# EAGLE design rascsi-right (EAGLE 8.0.1)
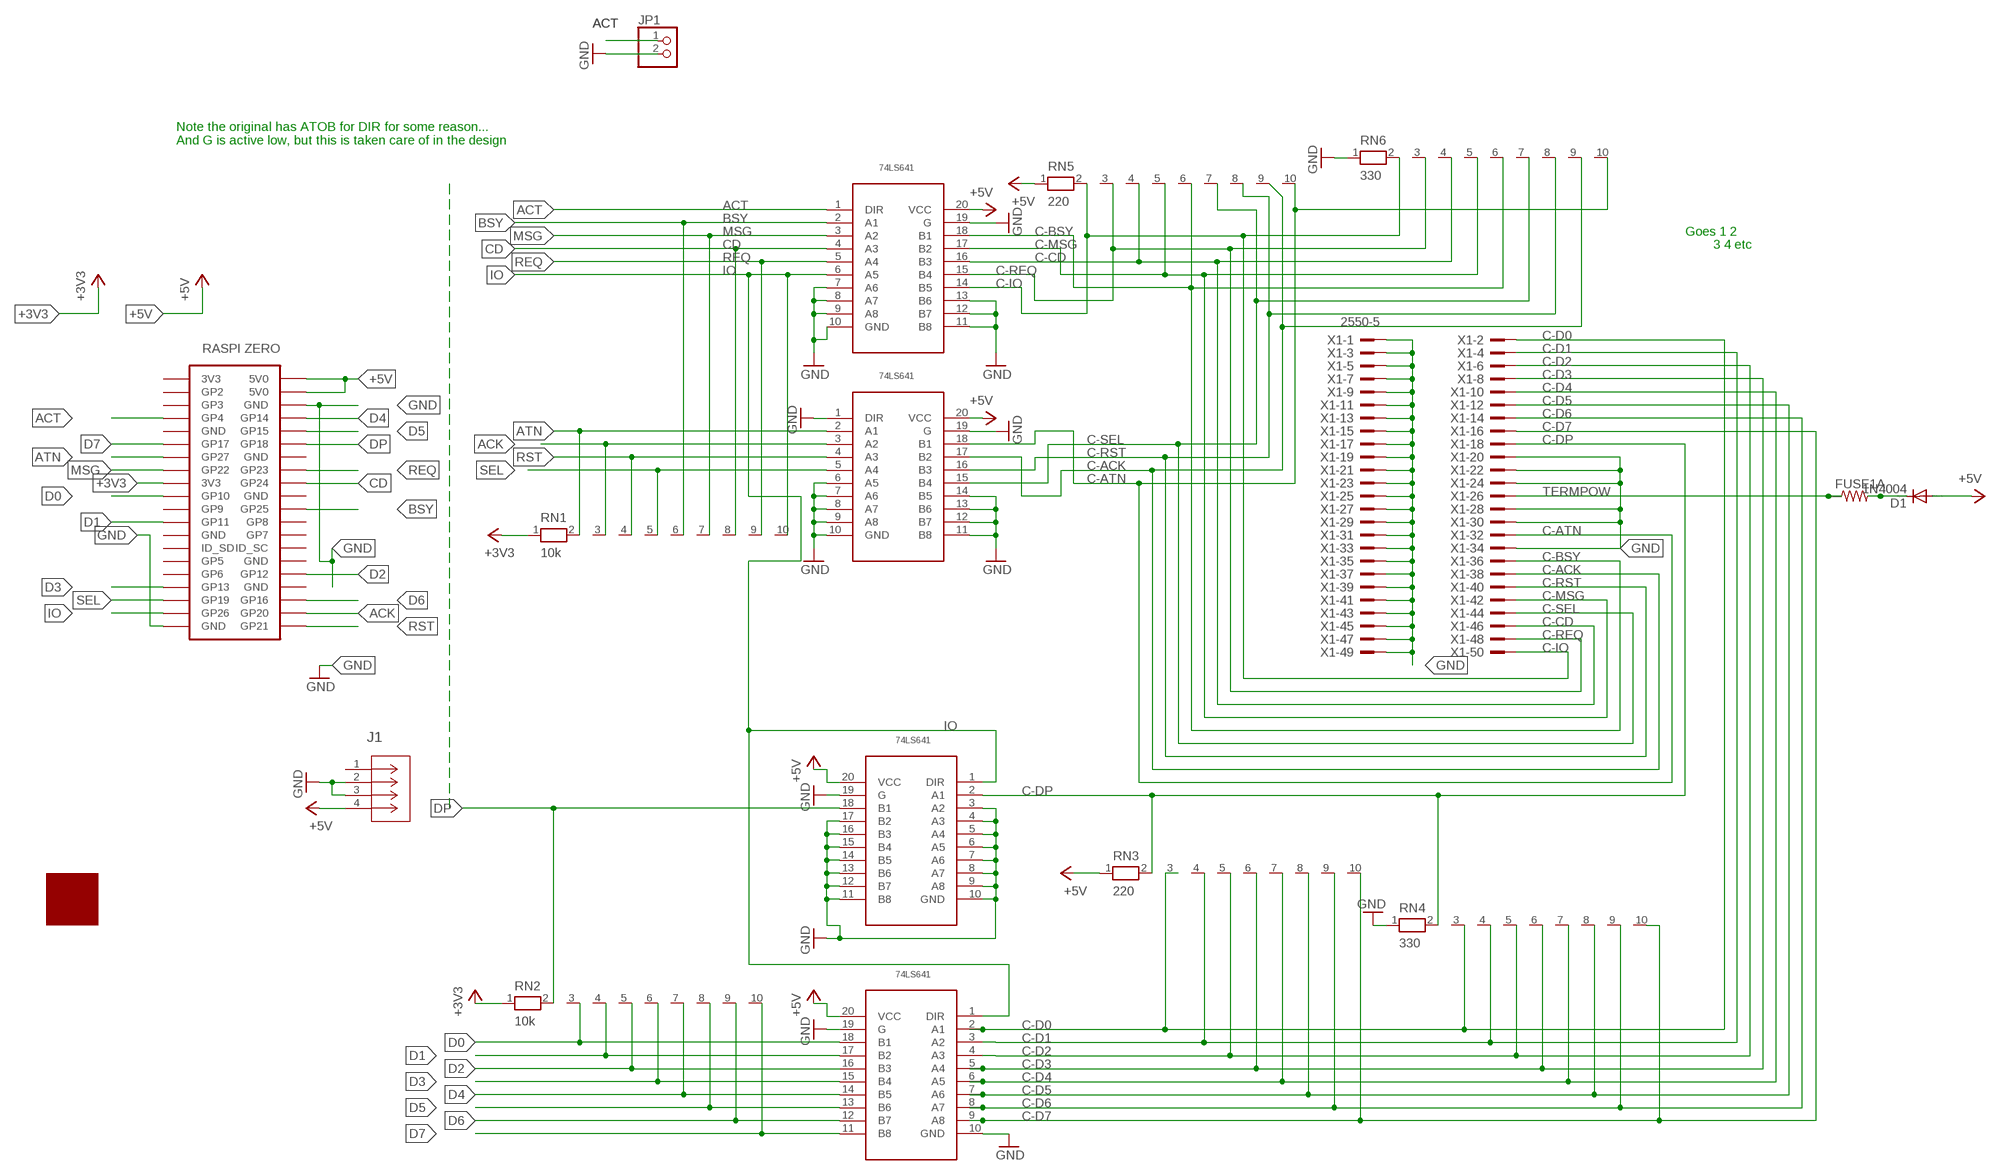
[diagram p0: schematic, sheet 1]

## Parts
D1  1N4004  [DO41-10]
FUSE1A  R-US_0204/7  [0204/7]
J1  171826-4  [CONN_171826-4_TYCO]
JP1  PINHD-1X2  [1X02]
RN1  10k  RN09  [RN-10]
RN2  10k  RN09  [RN-10]
RN3  220  RN09  [RN-10]
RN4  330  RN09  [RN-10]
RN5  220  RN09  [RN-10]
RN6  330  RN09  [RN-10]
U11  SN74LS641-1SC  [SOIC20S]
U22  SN74LS641-1SC  [SOIC20S]
U33  SN74LS641-1SC  [SOIC20S]
U44  SN74LS641-1SC  [SOIC20S]
U$1  ZERO  [ZERO]
U$2  LOGO  [LOGO]
X1  2550-5  [PAK100/2500-5-50]

## Nets
+3V3: RN1.1 RN2.1 U$1.17(3V3)
+5V: D1.A J1.4 RN3.1 RN5.1 U11.20(VCC) U22.20(VCC) U33.20(VCC) U44.20(VCC) U$1.2(5V0) U$1.4(5V0)
ACK: RN1.3 U22.3(A2) U$1.38(GP20)
ACT: JP1.1 U11.1(DIR) U$1.7(GP4)
ATN: RN1.2 U22.2(A1) U$1.13(GP27)
BSY: RN1.6 U11.2(A1) U$1.22(GP25)
C-ACK: RN5.9 RN6.9 U22.17(B2) X1.38
C-ATN: RN5.10 RN6.10 U22.18(B1) X1.32
C-BSY: RN5.6 RN6.6 U11.18(B1) X1.36
C-CD: RN5.4 RN6.4 U11.16(B3) X1.46
C-D0: RN3.3 RN4.3 U44.2(A1) X1.2
C-D1: RN3.4 RN4.4 U44.3(A2) X1.4
C-D2: RN3.5 RN4.5 U44.4(A3) X1.6
C-D3: RN3.6 RN4.6 U44.5(A4) X1.8
C-D4: RN3.7 RN4.7 U44.6(A5) X1.10
C-D5: RN3.8 RN4.8 U44.7(A6) X1.12
C-D6: RN3.9 RN4.9 U44.8(A7) X1.14
C-D7: RN3.10 RN4.10 U44.9(A8) X1.16
C-DP: RN3.2 RN4.2 U33.2(A1) X1.18
C-IO: RN5.2 RN6.2 U11.14(B5) X1.50
C-MSG: RN5.5 RN6.5 U11.17(B2) X1.42
C-REQ: RN5.3 RN6.3 U11.15(B4) X1.48
C-RST: RN5.8 RN6.8 U22.16(B3) X1.40
C-SEL: RN5.7 RN6.7 U22.15(B4) X1.44
CD: RN1.8 U11.4(A3) U$1.18(GP24)
D0: RN2.3 U44.18(B1) U$1.19(GP10)
D1: RN2.4 U44.17(B2) U$1.23(GP11)
D2: RN2.5 U44.16(B3) U$1.32(GP12)
D3: RN2.6 U44.15(B4) U$1.33(GP13)
D4: RN2.7 U44.14(B5) U$1.8(GP14)
D5: RN2.8 U44.13(B6) U$1.10(GP15)
D6: RN2.9 U44.12(B7) U$1.36(GP16)
D7: RN2.10 U44.11(B8) U$1.11(GP17)
DP: RN2.2 U33.18(B1) U$1.12(GP18)
GND: J1.2 J1.3 JP1.2 RN4.1 RN6.1 U11.7(A6) U11.8(A7) U11.9(A8) U11.10(GND) U11.11(B8) U11.12(B7) U11.13(B6) U11.19(G) U22.1(DIR) U22.6(A5) U22.7(A6) U22.8(A7) U22.9(A8) U22.10(GND) U22.11(B8) U22.12(B7) U22.13(B6) U22.14(B5) U22.19(G) U33.3(A2) U33.4(A3) U33.5(A4) U33.6(A5) U33.7(A6) U33.8(A7) U33.9(A8) U33.10(GND) U33.11(B8) U33.12(B7) U33.13(B6) U33.14(B5) U33.15(B4) U33.16(B3) U33.17(B2) U33.19(G) U44.10(GND) U44.19(G) U$1.6(GND) U$1.39(GND) X1.1 X1.3 X1.5 X1.7 X1.9 X1.11 X1.13 X1.15 X1.17 X1.19 X1.20 X1.21 X1.22 X1.23 X1.24 X1.25 X1.27 X1.28 X1.29 X1.30 X1.31 X1.33 X1.34 X1.35 X1.37 X1.39 X1.41 X1.43 X1.45 X1.47 X1.49
IO: RN1.10 U11.6(A5) U33.1(DIR) U44.1(DIR) U$1.37(GP26)
MSG: RN1.7 U11.3(A2) U$1.15(GP22)
N$4: D1.C FUSE1A.2
REQ: RN1.9 U11.5(A4) U$1.16(GP23)
RST: RN1.4 U22.4(A3) U$1.40(GP21)
SEL: RN1.5 U22.5(A4) U$1.35(GP19)
TERMPOW: FUSE1A.1 X1.26
Unconnected: J1.1 U$1.1(3V3) U$1.3(GP2) U$1.5(GP3) U$1.9(GND) U$1.14(GND) U$1.20(GND) U$1.21(GP9) U$1.24(GP8) U$1.25(GND) U$1.26(GP7) U$1.27(ID_SD) U$1.28(ID_SC) U$1.29(GP5) U$1.30(GND) U$1.31(GP6) U$1.34(GND)

## Notes on the sheet
- Note the original has ATOB for DIR for some reason...
  And G is active low, but this is taken care of in the design
- Goes 1 2
- 3 4 etc

## Library data of the parts
D1 = diode:1N4004: DIODE general purpose rectifier, 1 A
FUSE1A = resistor:R-US_: RESISTOR, American symbol
J1 = floppy-power:171826-4; MANUFACTURER_PART_NUMBER: 1718264; VENDOR: Tyco Electronics
JP1 = pinhead:PINHD-1X2: PIN HEADER
RN1-RN6 = resistor-net:RN09: RESISTOR NETWORK; OC_FARNELL: unknown; OC_NEWARK: unknown
U11 U22 U33 U44 = capstuff:SN74LS641-1: Octual Bus Trans.
U$1 = RasPi:ZERO: Raspbery Pi Foundation Zero https://www.raspberrypi.org/products/pi-zero/
U$2 = capstuff:LOGO
X1 = con-3m:2550-: 3M (TM) Pak 100 4-Wall Header Source: 3M; OC_FARNELL: 1788696; OC_NEWARK: unknown

## Board
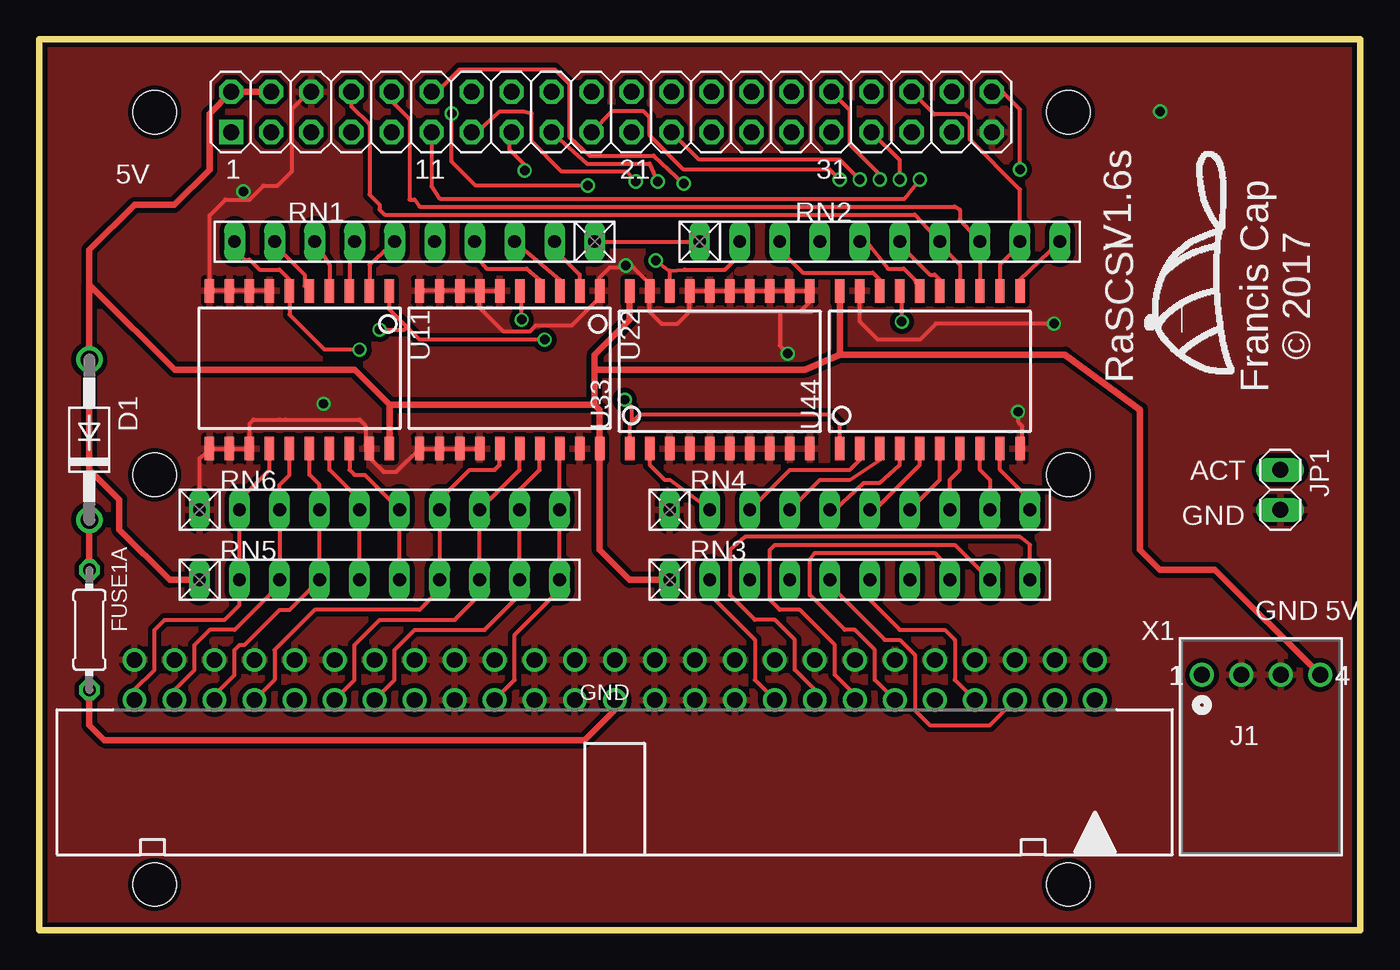
[diagram p1: board, top side]
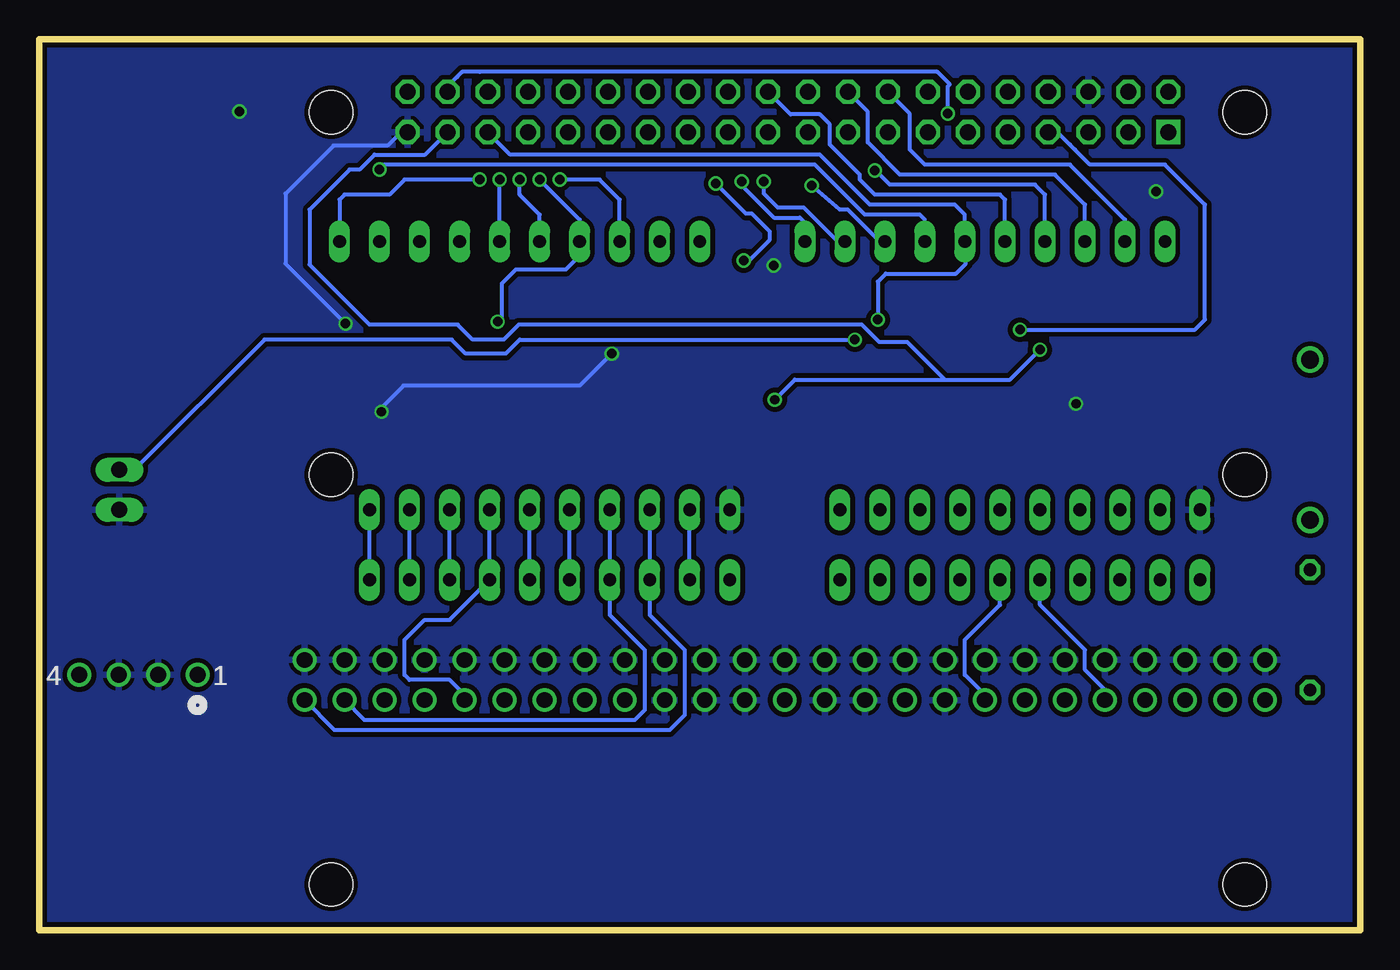
[diagram p2: board, bottom side, seen from below]

Size 83.82 x 56.52 mm. Coordinates in mm from the lower left corner, seen from the top.
Outline: 0,56.52 0,0 83.82,0 83.82,56.52 0,56.52
Copper layers (1*16): Top 0.035mm / dielectric 1.5mm / Bottom 0.035mm
Design rules "dirt_cheap_dirty_boards.v1": minimum track width 5mil, minimum drill 12mil, track to track 5mil, track to pad 5mil, pad to pad 5mil, via to via 5mil, smd to smd 0mil, copper to edge 10mil, drill to drill 10mil, minimum pad ring 10mil, minimum via ring 6mil, stop-mask expansion 2mil, vias tented up to drill 25mil, thermal gap 10mil

### Footprints (pad centres in the part's own frame; a part is rotated, then mirrored left to right if it is on the bottom)
DO41-10 = drill 1.118: A 5.08,0; C -5.08,0
0204/7 = drill 0.813 octagon: 1 -3.81,0; 2 3.81,0
CONN_171826-4_TYCO = drill 1.016 pad 1.524: 1 -7.493,0; 2 -5.004,0; 3 -2.489,0; 4 0,0
1X02 = drill 1.016 long: 1 -1.27,0; 2 1.27,0
RN-10 = drill 0.813 long: 1 -11.43,0; 2 -8.89,0; 3 -6.35,0; 4 -3.81,0; 5 -1.27,0; 6 1.27,0; 7 3.81,0; 8 6.35,0; 9 8.89,0; 10 11.43,0
SOIC20S = smd 0.6 x 1.5: 1 -5.715,-5; 2 -4.445,-5; 3 -3.175,-5; 4 -1.905,-5; 5 -0.635,-5; 6 0.635,-5; 7 1.905,-5; 8 3.175,-5; 9 4.445,-5; 10 5.715,-5; 11 5.715,5; 12 4.445,5; 13 3.175,5; 14 1.905,5; 15 0.635,5; 16 -0.635,5; 17 -1.905,5; 18 -3.175,5; 19 -4.445,5; 20 -5.715,5
ZERO = drill 1.016 square: 1 8.37,25.24 | drill 1.016 octagon: 2 8.37,27.78; 3 10.91,25.24; 4 10.91,27.78; 5 13.45,25.24; 6 13.45,27.78; 7 15.99,25.24; 8 15.99,27.78; 9 18.53,25.24; 10 18.53,27.78; 11 21.07,25.24; 12 21.07,27.78; 13 23.61,25.24; 14 23.61,27.78; 15 26.15,25.24; 16 26.15,27.78; 17 28.69,25.24; 18 28.69,27.78; 19 31.23,25.24; 20 31.23,27.78; 21 33.77,25.24; 22 33.77,27.78; 23 36.31,25.24; 24 36.31,27.78; 25 38.85,25.24; 26 38.85,27.78; 27 41.39,25.24; 28 41.39,27.78; 29 43.93,25.24; 30 43.93,27.78; 31 46.47,25.24; 32 46.47,27.78; 33 49.01,25.24; 34 49.01,27.78; 35 51.55,25.24; 36 51.55,27.78; 37 54.09,25.24; 38 54.09,27.78; 39 56.63,25.24; 40 56.63,27.78 | hole 2.75: 3.5,3.5; 3.5,26.5; 61.5,26.5; 61.5,3.5; 3.5,-22.5; 61.5,-22.5
PAK100/2500-5-50 = drill 1 pad 1.422: 1 -30.48,-1.27; 2 -30.48,1.27; 3 -27.94,-1.27; 4 -27.94,1.27; 5 -25.4,-1.27; 6 -25.4,1.27; 7 -22.86,-1.27; 8 -22.86,1.27; 9 -20.32,-1.27; 10 -20.32,1.27; 11 -17.78,-1.27; 12 -17.78,1.27; 13 -15.24,-1.27; 14 -15.24,1.27; 15 -12.7,-1.27; 16 -12.7,1.27; 17 -10.16,-1.27; 18 -10.16,1.27; 19 -7.62,-1.27; 20 -7.62,1.27; 21 -5.08,-1.27; 22 -5.08,1.27; 23 -2.54,-1.27; 24 -2.54,1.27; 25 0,-1.27; 26 0,1.27; 27 2.54,-1.27; 28 2.54,1.27; 29 5.08,-1.27; 30 5.08,1.27; 31 7.62,-1.27; 32 7.62,1.27; 33 10.16,-1.27; 34 10.16,1.27; 35 12.7,-1.27; 36 12.7,1.27; 37 15.24,-1.27; 38 15.24,1.27; 39 17.78,-1.27; 40 17.78,1.27; 41 20.32,-1.27; 42 20.32,1.27; 43 22.86,-1.27; 44 22.86,1.27; 45 25.4,-1.27; 46 25.4,1.27; 47 27.94,-1.27; 48 27.94,1.27; 49 30.48,-1.27; 50 30.48,1.27

### Placement (x,y rotation side)
D1  3.18,31.12 90 top
FUSE1A  3.18,19.05 90 top
J1  81.28,16.19 0 top
JP1  78.74,27.94 270 top
RN1  23.81,43.69 180 top
RN2  53.34,43.69 0 top
RN3  51.43,22.23 0 top
RN4  51.43,26.67 0 top
RN5  21.59,22.23 0 top
RN6  21.59,26.67 0 top
U11  16.51,35.56 180 top
U22  29.84,35.56 180 top
U33  43.18,35.56 0 top
U44  56.51,35.56 0 top
U$1  3.81,25.4 0 top
U$2  75.88,35.24 90 top
X1  36.51,15.88 180 top

### Tracks (layer width: path | path; a pad name or v marks a point on that pad's centre or on a via)
+3V3  (via drill 0.6)
  Top 0.254: RN1.1 RN2.1 | 32.38,50.53 U$1.17 34.75,48.64 38.73,48.64 v39.24,47.5
  Bottom 0.254: RN1.1 35.24,44.89 35.56,45.21 37.21,45.21 39.24,47.24 v39.24,47.5
+5V
  Top 0.406: RN5.1 8.26,22.23 5.08,25.4 5.08,27.3 3.18,29.21 D1.A 3.18,40.96 3.49,40.64 | 22.23,33.34 20,35.56 8.57,35.56 3.49,40.64 | 22.23,33.34 U11.20 | 22.23,33.34 35.24,33.34 | 35.24,33.34 35.56,33.02 U22.20 35.56,24.13 37.46,22.23 RN3.1 | 35.24,33.34 35.24,35.56 | 35.24,35.56 35.24,36.51 37.46,38.73 U33.20 | 35.24,35.56 48.58,35.56 50.8,36.51 | 50.8,36.51 U44.20 | 50.8,36.51 65.09,36.51 69.85,33.02 69.85,24.13 71.12,22.86 74.61,22.86 J1.4 | U$1.4 U$1.2 10.79,51.8 10.79,48.26 8.55,46.01 6.06,46.01 3.18,43.18 3.18,40.64 3.49,40.64
ACK  (via drill 0.6)
  Top 0.254: RN1.3 33.02,41.28 U22.3 | v26.16,51.82 26.16,48.77 27.69,47.24 v34.8,47.24
  Bottom 0.254: U$1.38 57.9,53.54 57.31,54.13 | 57.31,54.13 56.99,54.45 | 55.88,54.45 26.83,54.45 26.04,53.66 26.16,53.53 v26.16,51.82 | RN1.3 30.61,43.81 32.51,45.72 33.02,45.72 v34.8,47.24 | 55.88,54.45 56.99,54.45 | 55.88,54.45 56.99,54.45 | 56.99,54.45 57.31,54.13
ACT  (via drill 0.6)
  Top 0.254: v32.07,37.47 24.13,37.47 23.34,38.26 | 23.34,38.26 22.23,39.37 U11.1 | v21.59,38.1 23.18,38.1 23.34,38.26
  Bottom 0.254: JP1.1 77.79,29.21 69.53,37.47 57.66,37.47 56.77,36.58 54.23,36.58 53.34,37.47 v32.07,37.47 | U$1.7 19.21,50.64 18.41,49.85 18.1,49.53 17.14,48.58 12.38,48.58 9.84,46.04 9.84,38.73 10.48,38.1 v21.59,38.1 21.91,38.1
ATN  (via drill 0.6)
  Top 0.254: RN1.2 32.7,43.18 34.29,41.59 U22.2 | U$1.13 27.78,50.64 29.21,51.94 30.73,51.94 31.24,51.82 31.24,50.04 33.15,48.13 37.34,48.13 v37.85,47.5
  Bottom 0.254: RN1.2 33.15,43.69 35.31,45.85 36.96,45.85 37.85,46.74 v37.85,47.5
BSY
  Top 0.254: RN1.6 20.96,42.23 U11.2
  Bottom 0.254: RN1.6 22.54,46.36 22.86,46.67 30.8,46.67 31.75,47.62 31.75,47.94 33.65,49.85 33.65,51.12 34.29,51.75 36.15,51.75 U$1.22
C-ACK
  Top 0.254: U22.17 31.75,29.21 30.48,27.94 RN6.9 RN5.9 30.16,21.91 30.16,20.95 28.26,19.05 23.81,19.05 22.54,17.78 22.54,15.88 X1.38
C-ATN
  Top 0.254: U22.18 RN6.10 RN5.10 32.7,21.91 32.7,21.27 30.16,18.73 30.16,15.88 X1.32
C-BSY
  Top 0.254: U11.18 19.68,29.21 20,28.89 20.64,28.89 RN6.6 RN5.6
  Bottom 0.254: X1.36 23.81,14.92 25.08,16.19 25.08,18.41 22.86,20.64 RN5.6
C-CD
  Top 0.254: U11.16 17.14,28.89 17.78,28.26 RN6.4 RN5.4 15.88,20.32 15.24,20.32 13.02,18.1 12.7,18.1 12.38,17.78 12.38,16.19 11.11,14.92 X1.46
C-D0
  Top 0.254: RN4.3 47.62,29.21 51.43,29.21 52.07,29.84 U44.2
  Bottom 0.254: RN4.3 RN3.3 45.08,20 42.86,17.78 42.86,13.65 43.81,12.7 65.09,12.7 X1.2
C-D1
  Top 0.254: RN4.4 49.53,28.58 51.43,28.58 53.34,29.84 U44.3
  Bottom 0.254: RN4.4 RN3.4 47.62,20 45.4,17.78 45.4,13.97 46.04,13.34 63.18,13.34 X1.4
C-D2
  Top 0.254: RN4.5 50.48,26.67 52.32,28.38 53.34,28.38 54.61,29.53 U44.4 | RN3.5 50.16,21.91 53.66,18.41 54.61,18.41 55.56,17.46 55.56,13.97 56.51,13.02 60.32,13.02 X1.6
  Bottom 0.254: RN3.5 RN4.5
C-D3
  Top 0.254: RN4.6 53.02,26.67 | 53.02,26.67 55.88,29.53 U44.5 | 52.7,26.35 53.02,26.67 | RN3.6 52.7,20.95 54.61,19.05 57.47,19.05 58.1,18.41 58.1,15.88 X1.8
  Bottom 0.254: RN3.6 RN4.6
C-D4
  Top 0.254: RN4.7 57.15,28.58 U44.6
  Bottom 0.254: RN4.7 RN3.7 57.78,19.69 59.37,19.69 60.64,18.41 60.64,16.19 60.32,15.88 57.78,15.88 56.83,14.92 X1.10
C-D5
  Top 0.254: RN4.8 57.78,28.58 58.42,29.21 U44.7 | X1.12 53.02,15.88 53.02,17.78 51.75,19.05 51.12,19.05 48.89,21.27 48.89,23.49 49.21,23.94 56.83,23.94 57.78,22.86 RN3.8
  Bottom 0.254: RN3.8 RN4.8
C-D6
  Top 0.254: RN4.9 60.32,28.58 59.69,29.21 U44.8 | X1.14 51.75,14.92 50.48,16.19 50.48,18.1 48.26,20.32 46.99,20.32 46.35,20.95 46.35,24.13 46.67,24.45 58.1,24.45 RN3.9
  Bottom 0.254: RN3.9 RN4.9
C-D7
  Top 0.254: RN4.10 62.87,27.3 60.96,29.21 U44.9 | X1.16 49.21,15.24 47.94,16.51 47.94,18.41 46.67,19.69 45.4,19.69 43.81,21.27 43.81,24.13 44.77,24.96 62.23,24.96 62.87,24.45 RN3.10
  Bottom 0.254: RN3.10 RN4.10
C-DP
  Top 0.254: U33.2 38.73,29.53 39.69,28.58 40,28.58 RN4.2 | RN3.2 42.54,21.27 45.4,18.41 45.4,15.88 X1.18
  Bottom 0.254: RN3.2 RN4.2
C-IO
  Top 0.254: U11.14 14.61,29.21 12.7,27.3 RN6.2 RN5.2 12.7,20.64 11.75,19.69 7.94,19.69 7.3,19.05 7.3,16.51 6.03,15.24 X1.50
C-MSG
  Top 0.254: U11.17 18.41,29.21 20.32,27.3 RN6.5 RN5.5
  Bottom 0.254: X1.42 16.19,15.24 17.46,16.51 17.46,17.78 20.32,20.64 RN5.5
C-REQ
  Top 0.254: U11.15 15.88,28.89 15.24,28.26 RN6.3 RN5.3 | X1.48 8.57,15.24 9.84,16.51 9.84,18.1 10.79,19.05 12.38,19.05 15.24,21.91 RN5.3 | RN5.3 15.24,21.59 RN5.3
C-RST
  Top 0.254: U22.16 30.48,29.21 RN6.8 RN5.8 27.94,21.27 26.35,19.69 21.59,19.69 20,18.1 20,15.88 X1.40
C-SEL
  Top 0.254: U22.15 29.21,29.53 28.89,29.21 27.3,29.21 25.4,27.3 RN6.7 RN5.7 25.4,21.59 24.13,20.32 17.46,20.32 14.92,17.78 14.92,15.88 X1.44
CD
  Top 0.254: U11.4 18.41,42.23 RN1.8
  Bottom 0.254: RN1.8 17.46,46.04 19.37,47.94 29.21,47.94 31.24,49.97 31.24,51.92 U$1.18
D0  (via drill 0.6)
  Top 0.254: RN2.3 46.99,43.18 48.45,41.72 52.9,41.72 53.34,41.28 U44.18 | v50.8,47.62 50.16,48.26 40.89,48.26 38.73,50.42 38.73,51.56 38.35,51.94 36.34,51.94 U$1.19
  Bottom 0.254: RN2.3 46.99,46.36 48.26,47.62 v50.8,47.62
D1  (via drill 0.6)
  Top 0.254: v52.07,47.62 50.8,48.89 41.86,48.89 U$1.23 | v54.74,38.61 54.74,40.43 U44.17
  Bottom 0.254: v52.07,47.62 49.53,45.08 RN2.4 49.53,42.8 50.42,41.91 53.59,41.91 54.48,41.02 54.48,38.86 v54.74,38.61
D2  (via drill 0.6)
  Top 0.254: RN2.5 52.39,43.81 53.85,41.97 54.86,41.97 55.56,41.28 U44.16 | v53.34,47.62 53.34,47.94 51.43,49.85 51.43,52.03 U$1.32
  Bottom 0.254: RN2.5 52.07,45.4 53.34,46.67 v53.34,47.62
D3  (via drill 0.6)
  Top 0.254: RN2.6 54.61,43.5 56.51,41.59 56.83,41.59 57.15,41.28 U44.15 | v54.61,47.62 54.61,48.85 U$1.33
  Bottom 0.254: RN2.6 v54.61,47.62
D4
  Top 0.254: U44.14 58.42,42.23 57.15,43.5 RN2.7 55.56,45.4 21.91,45.4 21.59,45.72 21.59,46.04 20.96,46.67 20.96,51.12 19.8,52.27 U$1.8
D5
  Top 0.254: U44.13 RN2.8 58.42,45.08 58.42,45.72 58.1,45.91 24.13,45.91 23.81,46.36 23.5,46.36 23.5,51.44 22.34,52.59 U$1.10
D6
  Top 0.254: U44.12 60.96,42.23 62.23,43.5 RN2.9 62.23,46.99 59.05,50.17 59.05,51.44 58.74,51.75 56.79,51.75 U$1.36
D7  (via drill 0.6)
  Top 0.254: U44.11 62.23,41.28 RN2.10 | U$1.11 24.88,47.19 25.4,46.42 54.93,46.42 v55.88,47.62
  Bottom 0.254: v55.88,47.62 60.64,47.62 61.59,46.67 64.45,46.67 64.77,46.36 RN2.10
DP  (via drill 0.6)
  Top 0.254: 40,41.85 U33.18 | 40,41.85 40.96,41.91 43.5,41.91 44.45,42.86 RN2.2 | U$1.12 25.24,53.18 26.67,54.61 32.7,54.61 33.65,53.66 33.65,50.29 34.92,49.15 38.99,49.15 v40.89,47.37 | v39.12,42.48 40,41.85
  Bottom 0.254: v39.12,42.48 38.73,42.55 37.46,43.81 37.46,44.32 38.61,45.47 38.99,45.47 v40.89,47.37
GND  (via drill 0.6)
  Top 0.254: U$1.6 17.11,53.18 16,52.07 16,48.13 15.11,47.24 14.22,47.24 13.34,46.36 11.81,46.36 10.79,45.34 U11.10 U11.7 | 35.73,40.56 U22.1 | U22.1 35.56,41.4 36.2,42.04 37.72,42.04 38.73,41.02 U33.19 38.73,39.24 39.5,38.48 40.51,38.48 41.27,39.24 | U22.1 35.56,40.13 33.78,38.35 31.5,38.35 31.11,37.97 29.46,37.97 27.94,39.5 U22.7 | U22.7 U22.6 | U22.7 U22.8 U22.9 U22.10 | 41.27,39.24 U33.17 U33.16 U33.15 U33.14 U33.13 U33.12 U33.11 48.89,39.88 48.26,39.24 | 48.26,39.24 46.99,39.24 | 46.99,39.24 41.27,39.24 | 48.26,39.24 49.02,39.24 | v64.39,38.48 56.9,38.48 55.88,37.47 53.21,37.47 52.07,38.61 U44.19 | RN6.1 10.16,29.92 U11.11 U11.12 U11.13 13.34,32.13 13.59,32.38 20.32,32.38 20.7,32 20.7,30.81 U11.19 20.96,29.97 21.84,29.08 22.65,29.08 U22.11 U22.12 U22.13 U22.14 | 15.24,32.38 15.62,32.38 | 46.99,39.24 46.99,37.08 v47.5,36.58 | v62.1,32.89 62.1,32.26 62.36,32 62.36,30.69 U44.10
  Bottom 0.254: U$1.39 60.87,50.64 61.72,49.78 65.15,49.78 68.2,46.74 68.2,42.29 v64.39,38.48 | v47.5,36.58 49.53,34.54 60.71,34.54 62.1,33.15 v62.1,32.89
  other vias: 18.03,33.4 71.12,51.94 12.95,46.86 37.21,42.16
  pour Top (isolate 0.305): 0.23,56.67 87.86,56.67 87.86,-0.36 0.23,0.28
  pour Bottom (isolate 0.305): -0.15,56.62 87.88,56.62 87.88,-0.23 -0.15,-0.23
IO  (via drill 0.6)
  Top 0.254: U44.1 50.8,32.07 50.16,32.7 38.1,32.7 37.62,32.23 | U33.1 37.46,32.07 37.62,32.23 | 37.62,32.23 37.62,33.18 v37.15,33.66 | v20.32,36.83 18.1,36.83 15.88,39.05 U11.6 15.88,41.28 15.24,41.91 13.97,41.91 13.34,42.55 13.02,42.55 12.38,43.18 RN1.10
  Bottom 0.254: v37.15,33.66 35.88,34.92 26.35,34.92 | 26.35,34.92 22.23,34.92 v20.32,36.83 | 26.35,34.92 28.73,37.31 30.51,37.31 31.62,38.42 53.4,38.42 54.36,37.47 56.32,37.47 57.28,38.42 62.87,38.42 66.67,42.23 66.67,45.72 64.14,48.26 63.5,48.26 62.55,49.21 59.33,49.21 U$1.37
MSG  (via drill 0.6)
  Top 0.254: RN1.7 20,42.86 19.68,42.55 U11.3 | v30.8,48.2 30.8,48.58 29.84,49.53 29.84,50.53 U$1.15
  Bottom 0.254: RN1.7 20,46.67 20.64,47.31 29.84,47.31 30.48,47.94 v30.8,48.2
N$4
  Top 0.406: FUSE1A.2 D1.C
REQ
  Top 0.254: RN1.9 14.61,43.81 16.83,41.59 16.83,40.88 U11.5
  Bottom 0.254: RN1.9 14.92,45.08 18.41,48.58 27.62,48.58 28.57,49.53 28.57,51.8 U$1.16
RST  (via drill 0.6)
  Top 0.254: RN1.4 27.62,42.86 28.38,41.97 30.92,41.97 31.75,41.28 U22.4 | v62.23,48.26 62.23,52.07 60.96,53.34 60.6,53.34 U$1.40
  Bottom 0.254: RN1.4 27.62,45.08 27.94,45.4 31.43,45.4 34.61,48.58 61.91,48.58 v62.23,48.26
SEL  (via drill 0.6)
  Top 0.254: v30.61,38.73 30.61,40.43 U22.5
  Bottom 0.254: U$1.35 53.93,49.21 34.29,49.21 31.11,46.04 25.72,46.04 25.08,45.4 RN1.5 25.02,43.62 25.02,42.29 25.65,41.66 30.1,41.66 30.61,41.15 v30.61,38.73
TERMPOW
  Top 0.406: FUSE1A.1 3.18,13.02 4.13,12.06 34.61,12.06 36.51,13.97 X1.26

### Text on the board
tPlace: 5V | Francis Cap | V1.6s | RaSCSI | ACT | GND | GND | 5V | GND
tNames: © 2017